# Altium schematic sheet Wedka_schemat.SchDoc
size A3; SheetNumber: 1; SheetTotal: 1
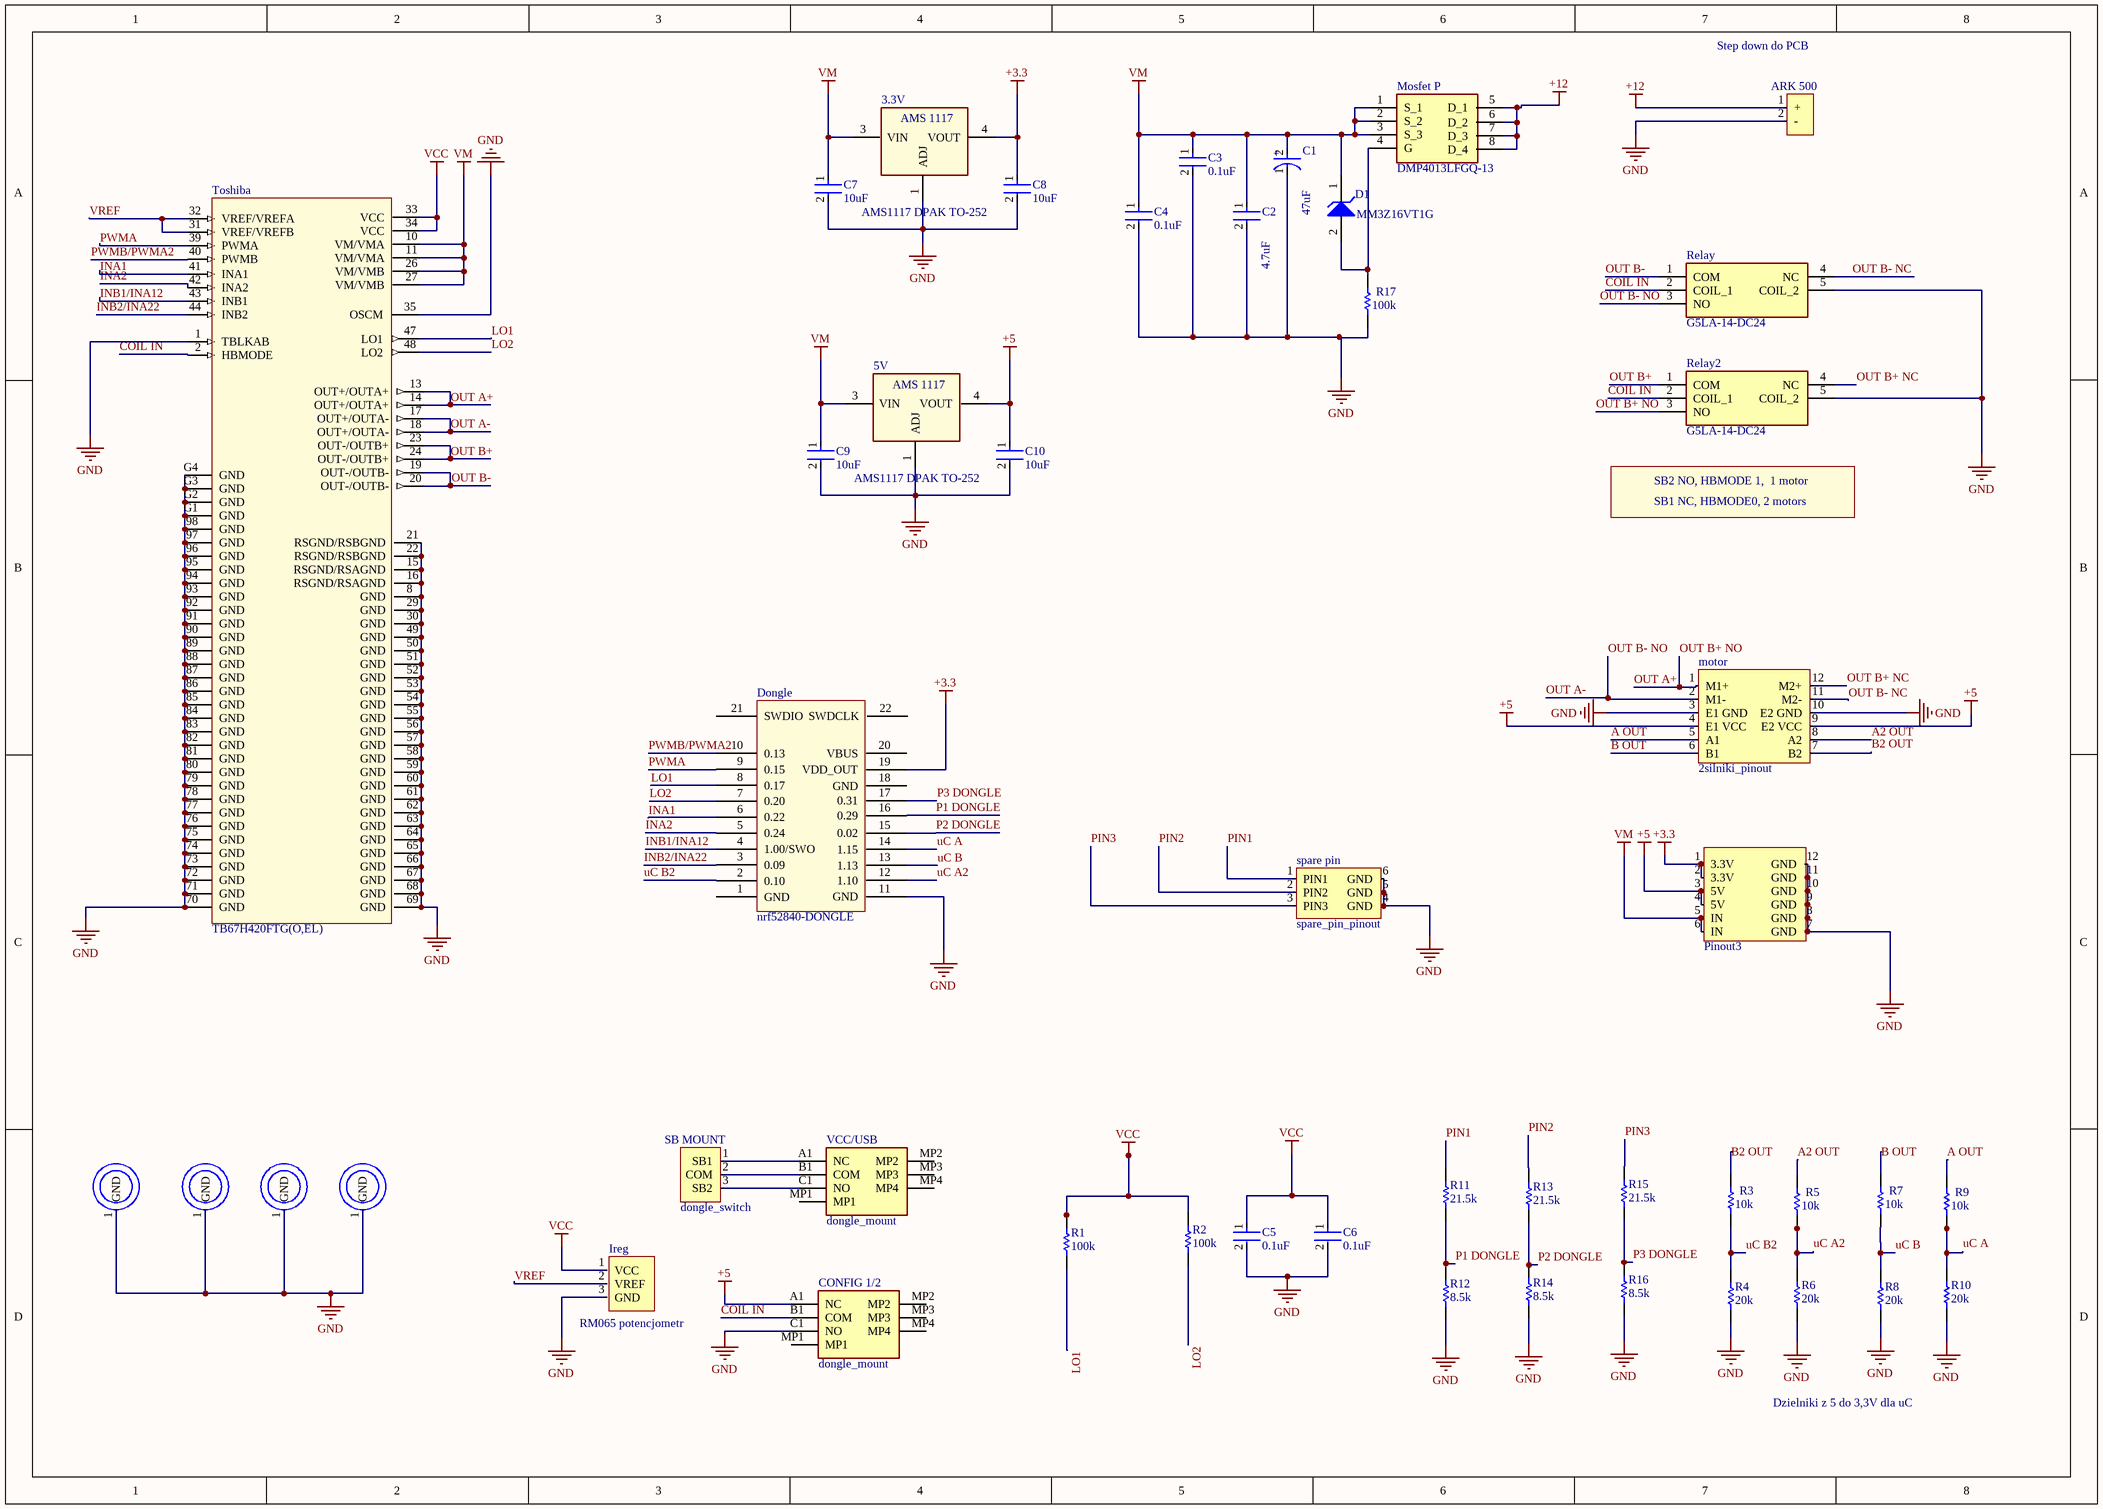
[diagram p0: Wedka_schemat.SchDoc]

## Parts
1  (no value)  [PTH]
2  (no value)  [PTH]
3  (no value)  [PTH]
3.3V  AMS1117 DPAK TO-252  [AMS1117CD]
4  4  [PTH]  (value not drawn)
5V  AMS1117 DPAK TO-252  [AMS1117CD]
?  ARK 500  [AK 500]
C1  47uF  [FP-FTD-MFG]
C2  4.7uF  [FP-C0805C475K3PACTU-MFG]
C3  0.1uF  [FP-C0805C104M5UACTU-MFG]
C4  0.1uF  [FP-C0805C104M5UACTU-MFG]
C5  0.1uF  [FP-C0805C104M5UACTU-MFG]
C6  0.1uF  [FP-C0805C104M5UACTU-MFG]
C7  10uF  [FP-GRM21B-0_1-IPC_C]
C8  10uF  [FP-GRM21B-0_1-IPC_C]
C9  10uF  [FP-GRM21B-0_1-IPC_C]
C10  10uF  [FP-GRM21B-0_1-IPC_C]
CONFIG_1/2  dongle_mount  [dongle_mount]
D1  MM3Z16VT1G  [ONSC-SOD-323-2-477-02_V]
Dongle  nrf52840-DONGLE  [nrf52840]
Ireg  RM065 potencjometr  [Potenciometer]
Mosfet_P  DMP4013LFGQ-13  [DMP4013LFGQ-13]
motor  2silniki_pinout  [2_silniki_pinout]
R1  100k  [RESC2013X60X35ML10T20]
R2  100k  [RESC2013X60X35ML10T20]
R3  10k  [RESC2013X60X35ML10T20]
R4  20k  [RESC2013X60X35ML10T20]
R5  10k  [RESC2013X60X35ML10T20]
R6  20k  [RESC2013X60X35ML10T20]
R7  10k  [RESC2013X60X35ML10T20]
R8  20k  [RESC2013X60X35ML10T20]
R9  10k  [RESC2013X60X35ML10T20]
R10  20k  [RESC2013X60X35ML10T20]
R11  21.5k  [RESC2013X60X35ML10T20]
R12  8.5k  [RESC2013X60X35ML10T20]
R13  21.5k  [RESC2013X60X35ML10T20]
R14  8.5k  [RESC2013X60X35ML10T20]
R15  21.5k  [RESC2013X60X35ML10T20]
R16  8.5k  [RESC2013X60X35ML10T20]
R17  100k  [RESC2013X60X35ML10T20]
Relay  G5LA-14-DC24  [G5LA14DC24]
Relay2  G5LA-14-DC24  [G5LA14DC24]
SB_MOUNT  dongle_switch  [switch_dongle]
spare_pin  spare_pin_pinout  [spare_pinout]
Toshiba  TB67H420FTG(O,EL)  [Toshiba]
VCC/USB  dongle_mount  [dongle_mount]
voltage  Pinout3  [pinout3]  (part B of 2)

## Nets
+3.3: 3.3V.4(VOUT) C8.1 Dongle.19(VDD_OUT) voltage.1(3.3V) voltage.2(3.3V)
+5: 5V.4(VOUT) C10.1 CONFIG_1/2.A1(NC) motor.4(E1_VCC) motor.9(E2_VCC) voltage.3(5V) voltage.4(5V)
+12: ?.1(+) Mosfet_P.5(D_1) Mosfet_P.6(D_2) Mosfet_P.7(D_3) Mosfet_P.8(D_4)
GND: 1.1(GND) 2.1(GND) 3.1(GND) 3.3V.1(ADJ) 4.1(GND) 5V.1(ADJ) ?.2(-) C1.1(C) C2.2 C3.2 C4.2 C5.2 C6.2 C7.2 C8.2 C9.2 C10.2 CONFIG_1/2.C1(NO) Dongle.11(GND) Ireg.3(GND) motor.3(E1_GND) motor.10(E2_GND) R4.1 R6.1 R8.1 R10.1 R12.1 R14.1 R16.1 R17.1 Relay.5(COIL_2) Relay2.5(COIL_2) spare_pin.4(GND) spare_pin.5(GND) spare_pin.6(GND) Toshiba.1(TBLKAB) Toshiba.8(GND) Toshiba.15(RSGND/RSAGND) Toshiba.16(RSGND/RSAGND) Toshiba.21(RSGND/RSBGND) Toshiba.22(RSGND/RSBGND) Toshiba.29(GND) Toshiba.30(GND) Toshiba.35(OSCM) Toshiba.49(GND) Toshiba.50(GND) Toshiba.51(GND) Toshiba.52(GND) Toshiba.53(GND) Toshiba.54(GND) Toshiba.55(GND) Toshiba.56(GND) Toshiba.57(GND) Toshiba.58(GND) Toshiba.59(GND) Toshiba.60(GND) Toshiba.61(GND) Toshiba.62(GND) Toshiba.63(GND) Toshiba.64(GND) Toshiba.65(GND) Toshiba.66(GND) Toshiba.67(GND) Toshiba.68(GND) Toshiba.69(GND) Toshiba.70(GND) Toshiba.71(GND) Toshiba.72(GND) Toshiba.73(GND) Toshiba.74(GND) Toshiba.75(GND) Toshiba.76(GND) Toshiba.77(GND) Toshiba.78(GND) Toshiba.79(GND) Toshiba.80(GND) Toshiba.81(GND) Toshiba.82(GND) Toshiba.83(GND) Toshiba.84(GND) Toshiba.85(GND) Toshiba.86(GND) Toshiba.87(GND) Toshiba.88(GND) Toshiba.89(GND) Toshiba.90(GND) Toshiba.91(GND) Toshiba.92(GND) Toshiba.93(GND) Toshiba.94(GND) Toshiba.95(GND) Toshiba.96(GND) Toshiba.97(GND) Toshiba.98(GND) Toshiba.G1(GND) Toshiba.G2(GND) Toshiba.G3(GND) Toshiba.G4(GND) voltage.7(GND) voltage.8(GND) voltage.9(GND) voltage.10(GND) voltage.11(GND) voltage.12(GND)
VCC: C5.1 C6.1 Ireg.1(VCC) R1.2 R2.2 Toshiba.33(VCC) Toshiba.34(VCC)
VM: 3.3V.3(VIN) 5V.3(VIN) C1.2(A) C2.1 C3.1 C4.1 C7.1 C9.1 D1.1(K) Mosfet_P.1(S_1) Mosfet_P.2(S_2) Mosfet_P.3(S_3) Toshiba.10(VM/VMA) Toshiba.11(VM/VMA) Toshiba.26(VM/VMB) Toshiba.27(VM/VMB) voltage.5(IN) voltage.6(IN)
A2 OUT: motor.8(A2) R5.2
A OUT: motor.5(A1) R9.2
B2 OUT: motor.7(B2) R3.2
B OUT: motor.6(B1) R7.2
COIL IN: CONFIG_1/2.B1(COM) Relay.2(COIL_1) Relay2.2(COIL_1) Toshiba.2(HBMODE)
INA1: Dongle.6(0.22) Toshiba.41(INA1)
INA2: Dongle.5(0.24) Toshiba.42(INA2)
INB1/INA12: Dongle.4(1.00/SWO) Toshiba.43(INB1)
INB2/INA22: Dongle.3(0.09) Toshiba.44(INB2)
LO1: Dongle.8(0.17) R1.1 Toshiba.47(LO1)
LO2: Dongle.7(0.20) R2.1 Toshiba.48(LO2)
OUT A+: motor.1(M1+) Relay2.3(NO) Toshiba.13(OUT+/OUTA+) Toshiba.14(OUT+/OUTA+)  [also labelled OUT B+ NO]
OUT A-: motor.2(M1-) Relay.3(NO) Toshiba.17(OUT+/OUTA-) Toshiba.18(OUT+/OUTA-)  [also labelled OUT B- NO]
OUT B+: Relay2.1(COM) Toshiba.23(OUT-/OUTB+) Toshiba.24(OUT-/OUTB+)
OUT B+ NC: motor.12(M2+) Relay2.4(NC)
OUT B-: Relay.1(COM) Toshiba.19(OUT-/OUTB-) Toshiba.20(OUT-/OUTB-)
OUT B- NC: motor.11(M2-) Relay.4(NC)
P1 DONGLE: Dongle.16(0.29) R11.1 R12.2
P2 DONGLE: Dongle.15(0.02) R13.1 R14.2
P3 DONGLE: Dongle.17(0.31) R15.1 R16.2
PIN1: R11.2 spare_pin.1(PIN1)
PIN2: R13.2 spare_pin.2(PIN2)
PIN3: R15.2 spare_pin.3(PIN3)
PWMA: Dongle.9(0.15) Toshiba.39(PWMA)
PWMB/PWMA2: Dongle.10(0.13) Toshiba.40(PWMB)
uC A: Dongle.14(1.15) R9.1 R10.2
uC A2: Dongle.12(1.10) R5.1 R6.2
uC B: Dongle.13(1.13) R7.1 R8.2
uC B2: Dongle.2(0.10) R3.1 R4.2
VREF: Ireg.2(VREF) Toshiba.31(VREF/VREFB) Toshiba.32(VREF/VREFA)
NetD1_2: D1.2(A) Mosfet_P.4(G) R17.2
NetSB_MOUNT_1: SB_MOUNT.1(SB1) VCC/USB.A1(NC)
NetSB_MOUNT_2: SB_MOUNT.2(COM) VCC/USB.B1(COM)
NetSB_MOUNT_3: SB_MOUNT.3(SB2) VCC/USB.C1(NO)

Not connected (* = marked no-connect by the designer): CONFIG_1/2 MP1 MP2 MP3 MP4; Dongle 1(GND) 18(GND) 20(VBUS) 21(SWDIO) 22(SWDCLK); VCC/USB MP1 MP2 MP3 MP4

## Notes on the sheet
- Step down do PCB
- SB1 NC, HBMODE0, 2 motors
- SB2 NO, HBMODE 1,  1 motor
- Dzielniki z 5 do 3,3V dla uC
- (in symbol AMS1117 DPAK) AMS 1117
- (in symbol CMP-05427-000060-1) +

## Library data of the parts
1-4 = PTH
3.3V 5V = AMS1117 DPAK
C1 = CMP-05427-000060-1: CAP ALUM 47UF 20% 50V SMD; ESR (Equivalent Series Resistance): 680mR; Ripple Current (AC): 195mA; Dielectric Material: Aluminium; Leakage Current: 23.5uA; Life (Hours): 2000Hour; Lead Diameter: 0.65mm; Lead Pitch: 1.8mm; Voltage: 50V; Min Operating Temperature: -55°C; Capacitance: 47uF; Radiation Hardening: No; Series: FT; Contact Plating: Tin; Mount: Surface Mount; REACH SVHC: No SVHC; RoHS Compliant: Yes; Package Quantity: 1; Tolerance: 20%; Construction: Cylindrical; Max Operating Temperature: 105°C; Packaging: Tape and Reel; Length: 5.8mm; Number of Pins: 2; Diameter: 6.3mm; Voltage Rating (DC): 50V; Voltage Rating: 50V; Height - Seated (Max): 0.24inch; Height: 5.8mm; Lead Free: Lead Free; Case/Package: Radial; Ripple Current: 195mA; Termination: SMD/SMT
C2 = CMP-2007-01010-2: CAP CER 4.7UF 25V X5R 0805; Tolerance: 10%; Dielectric Material: Ceramic; Dissipation Factor: 5%; Length: 2mm; Number of Pins: 2; Voltage Rating (DC): 25V; Depth: 1.25mm; Min Operating Temperature: -55°C; Capacitance: 4.7uF; Series: C0805C; Lead Free: Lead Free; Dielectric: X5R; REACH SVHC: No SVHC; Termination: SMD/SMT; Mount: PCB; Package Quantity: 2500; Contact Plating: Tin; Case Code (Imperial): 0805; Max Operating Temperature: 85°C; Width: 1.2mm; Voltage: 25V; Case/Package: 0805; Packaging: Tape and Reel; Height: 1.25mm; RoHS Compliant: Yes; Construction: Flat; Case Code (Metric): 2012; Radiation Hardening: No
C3-C6 = CMP-2007-03742-2: CAP CER 0.1UF 50V Z5U 0805; Dielectric Material: Ceramic; Tolerance: 20%; Dissipation Factor: 4%; Capacitance: 100nF; Height: 0.78mm; Dielectric: Z5U; REACH SVHC: No SVHC; Min Operating Temperature: 10°C; Lead Pitch: 0.75mm; Construction: Flat; Mount: Surface Mount; Max Operating Temperature: 85°C; RoHS Compliant: Yes; Width: 1.2mm; Contact Plating: Tin; Thickness: 0.035inch; Series: C; Packaging: Tape and Reel; Package Quantity: 1; Voltage Rating (DC): 50V; Termination: SMD/SMT; Voltage: 50V; Case Code (Metric): 2012; Depth: 1.25mm; Radiation Hardening: No; Case/Package: 0805; Length: 2mm; Case Code (Imperial): 0805; Voltage Rating: 50V; Number of Pins: 2; Lead Free: Lead Free
C7-C10 = CMP-2007-03453-2: Chip Multilayer Ceramic Capacitors for General Purpose, 0805, 10uF, X5R, 15%, 10%, 16V; Radiation Hardening: No; Thickness: 0.053inch; Voltage Rating (DC): 16V; Lead Free: Lead Free; Package Quantity: 1; Width: 1.25mm; Case Code (Imperial): 0805; Depth: 1.25mm; Packaging: Tape and Reel; Dielectric: X5R; Max Operating Temperature: 85°C; Tolerance: 10%; Voltage Rating: 16V; Voltage: 16V; Capacitance: 10uF; Height: 1.25mm; Case Code (Metric): 2012; Material: Ceramic; Mount: Surface Mount; Case/Package: 0805; REACH SVHC: No SVHC; Length: 2mm; Min Operating Temperature: -55°C; Termination: SMD/SMT
D1 = CMP-1060-00709-1: Zener Voltage Regulator, 300 mW, 2-Pin SOD-323, Pb-Free, Tape and Reel; Manufacturer: On Semiconductor; VZ Typ (V): 16.2; P Max (W): 0.3; ComponentLink3URL: http://www.onsemi.com/pub_link/Collateral/477-02.PDF.1; ComponentLink1Description: Manufacturer URL; PackageReference: SOD-323-2-477-02; PackageVersion: Rev. H, 03/2007; Packing: Tape and Reel; PackageDescription: 2-Pin SOD, Body 1.7 x 1.25 mm; ComponentLink2URL: http://www.onsemi.cn/pub_link/Collateral/MM3Z2V4T1-D.PDF; ComponentLink3Description: Package Specification; DatasheetVersion: Rev. 9; ComponentLink1URL: http://www.onsemi.com/; RoHS: Pb-Free; Mounting Technology: Surface Mount; PartNumber: MM3Z16VT1G; ComponentLink2Description: Datasheet
R1-R17 = CMP-2100-03673-1: Chip Resistor, 0 Ohm, Jumper, +/- 5%, 0.125 W, -55 to 155 degC, 0805 (2012 Metric), RoHS, Tape and Reel; Manufacturer: Yageo; Power Rating: 125mW; Resistance: 0mOhm; Voltage Rating (DC): 150V; Temperature Coefficient: 200ppm/degreesC; Height: 0.5mm; Depth: 1.25mm; Case Code (Imperial): 0805; Lead Free: LeadFree; Military Standard: Not; Package Description: 2-Pin Surface Mounted Device, Body 2 x 1.25 mm; Case Code (Metric): 2012; Composition: ThickFilm; Voltage Rating: 150V; Manufacturer URL: http://www.yageo.com/; Packaging: TapeandReel; Package Reference: 0805; REACH SVHC: Unknown; Tolerance: 5%; Case/Package: 0805; Max Operating Temperature: 155degC; Number of Pins: 2; Min Operating Temperature: -55degC; RoHSCompliant: true; Length: 2mm; Datasheet URL: http://www.yageo.com/NewPortal/yageodocoutput?fileName=/pdf/R-Chip/PYu-RC_Group_51_RoHS_L_5.pdf; Termination: SMD/SMT; Radiation Hardening: No; Width: 1.25mm; Contact Plating: Tin; Datasheet Version: Rev. 5, 10/2016
Relay Relay2 = G5LA-14-DC24: Relay or Contactor; Manufacturer_Name: Omron Electronics; Datasheet Link: https://componentsearchengine.com/Datasheets/1/G5LA-14-DC24.pdf; Height: 15.8mm; Manufacturer_Part_Number: G5LA-14-DC24; Mouser Part Number: 653-G5LA-14-DC24; Mouser Price/Stock: https://www.mouser.com/Search/Refine.aspx?Keyword=653-G5LA-14-DC24
Toshiba = TB67H420FTG(O,EL): Bipolar Motor Driver CMOS PWM 48-QFN _7x7_; MP: TB67H420FTG_O,EL_; SnapEDA_Link: https://www.snapeda.com/parts/TB67H420FTG%28O%2CEL%29/avi/view-part/4448976/?ref=snap; Availability: Unavailable; Value: *; Price: None; MF: Toshiba; Package: None